# EAGLE design NixieTracker (EAGLE 7.1.0)
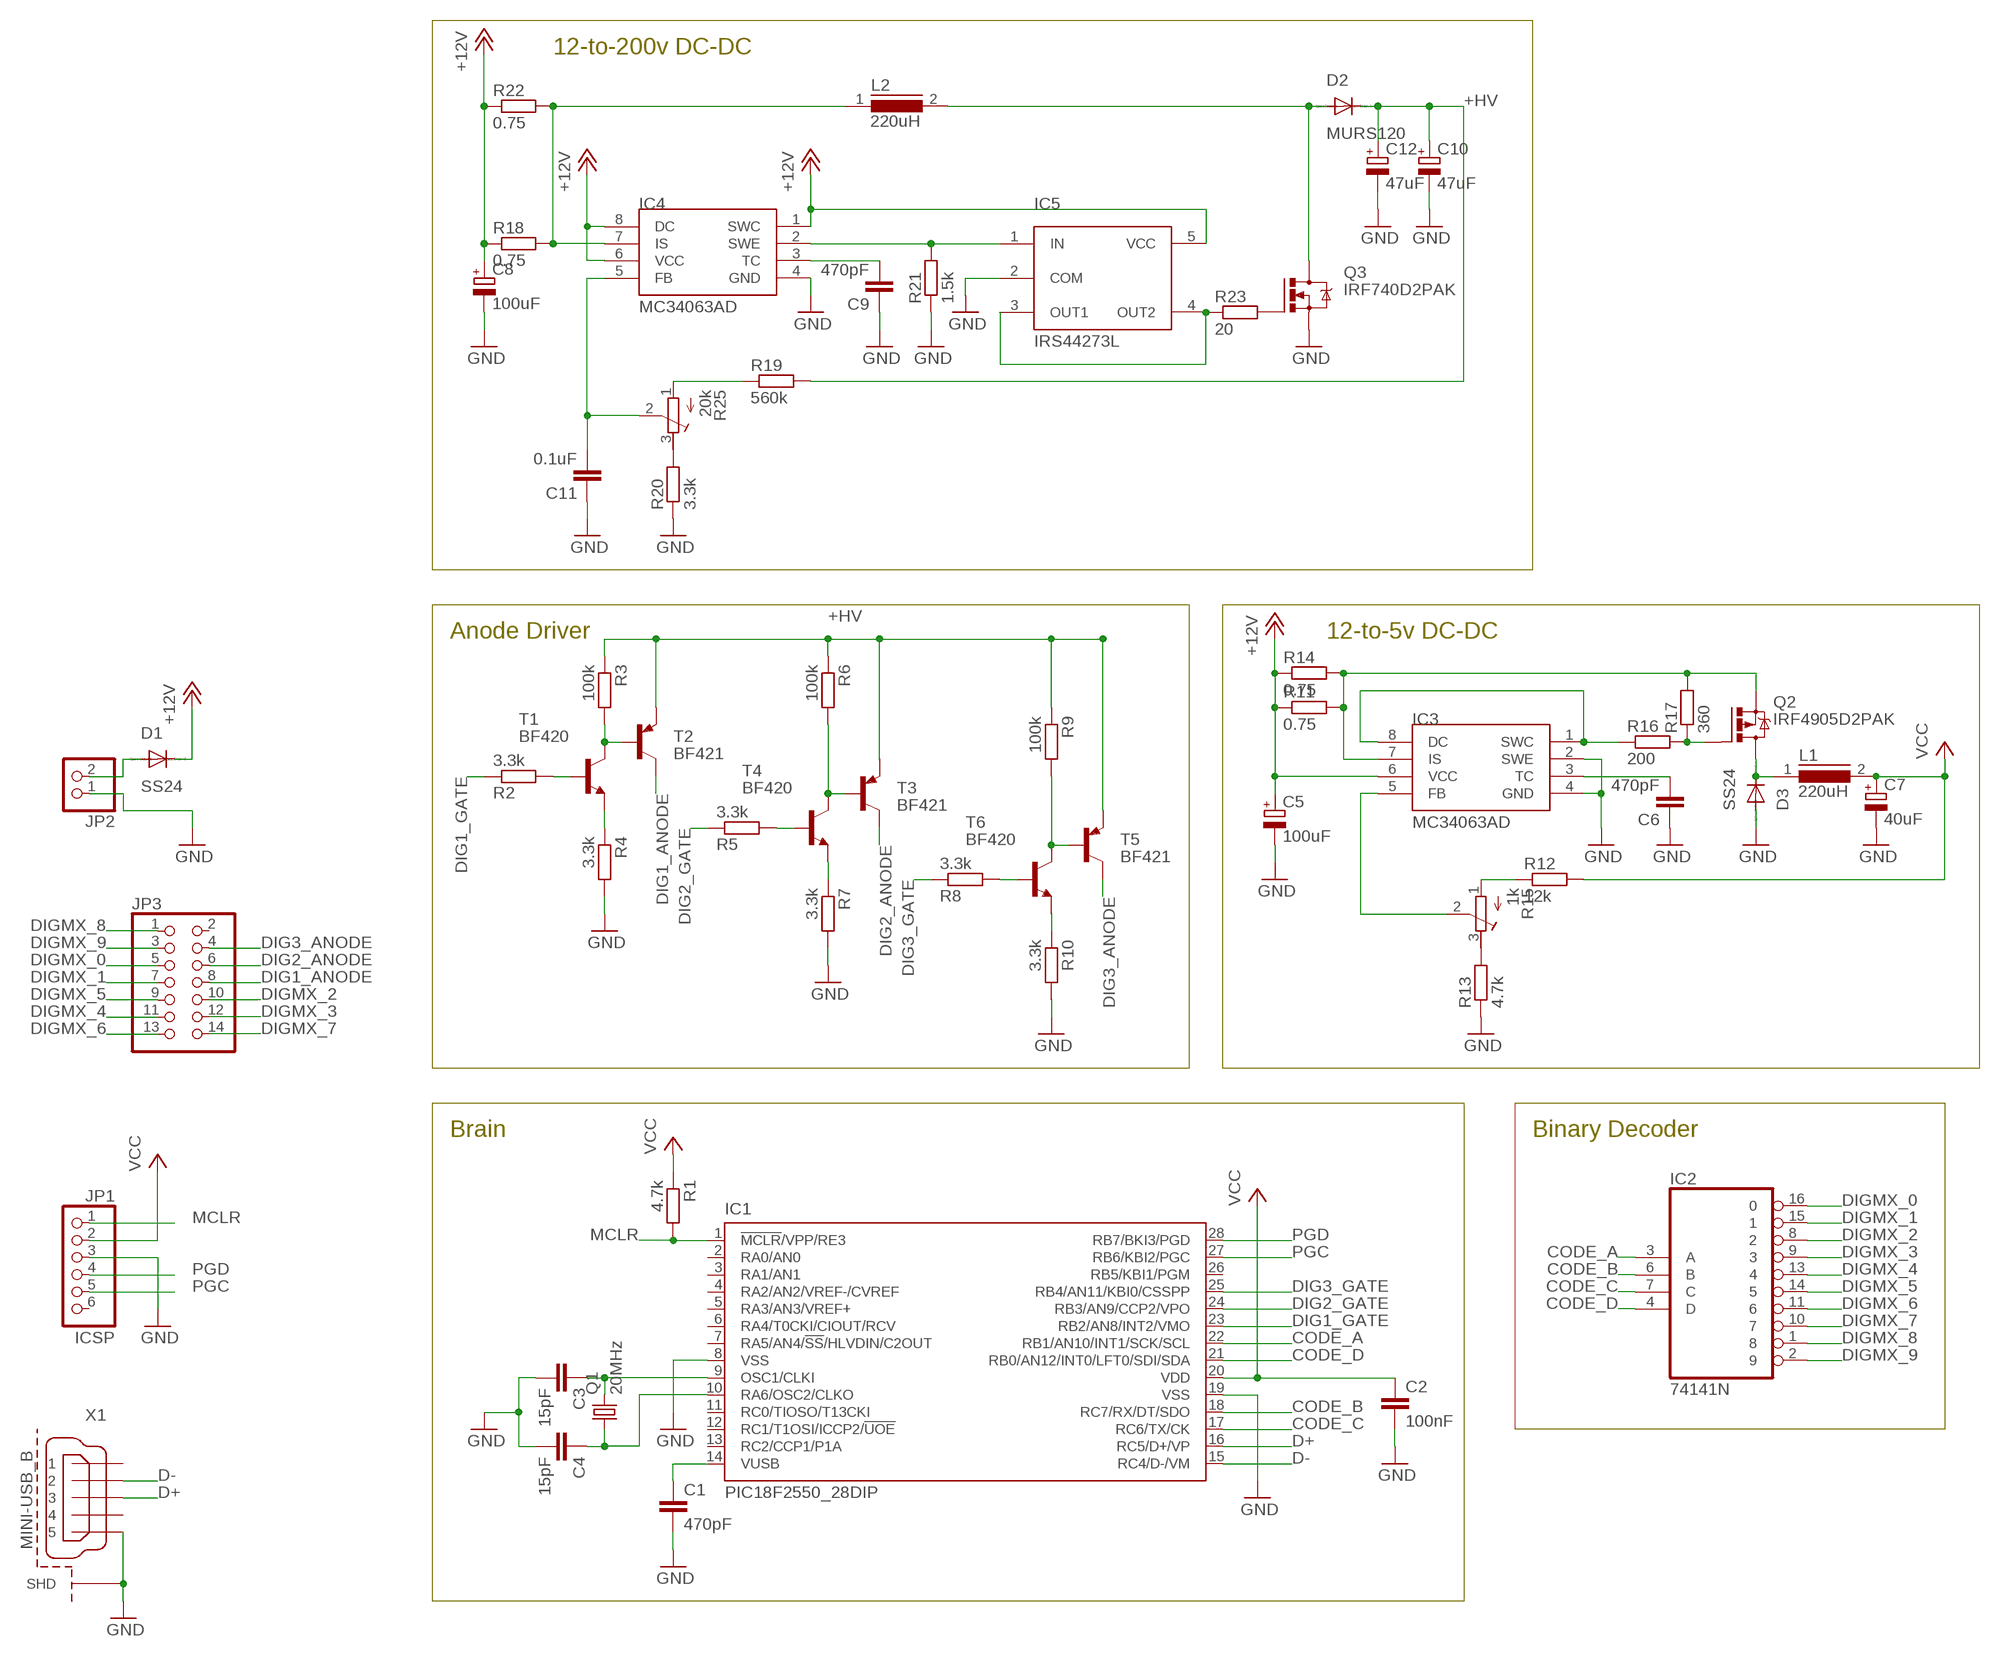
[diagram p0: schematic, sheet 1]

## Parts
C1  470pF  C-EU050-024X044  [C050-024X044]
C2  100nF  C-EU050-024X044  [C050-024X044]
C3  15pF  C-EU050-024X044  [C050-024X044]
C4  15pF  C-EU050-024X044  [C050-024X044]
C5  100uF  CPOL-EUD/7343-31R  [D/7343-31R]
C6  470pF  C-EUC1206K  [C1206K]
C7  40uF  CPOL-EUC/6032-28R  [C/6032-28R]
C8  100uF  CPOL-EUD/7343-31R  [D/7343-31R]
C9  470pF  C-EUC1206K  [C1206K]
C10  47uF  CPOL-EUSANYO_F13  [SANYO-OSCON_F13]
C11  0.1uF  C-EUC1206K  [C1206K]
C12  47uF  CPOL-EUSANYO_F13  [SANYO-OSCON_F13]
D1  SS24  DIODE-DO214AA  [DO214AA]
D2  MURS120  DIODE-DO214AA  [DO214AA]
D3  SS24  DIODE-DO214AA  [DO214AA]
IC1  PIC18F2550_28DIP  [DIL28-3]
IC2  74141N  [DIL16]
IC3  MC34063AD  [SOIC8]
IC4  MC34063AD  [SOIC8]
IC5  IRS44273L  [SOT23-5]
JP1  ICSP  PINHD-1X6  [1X06]
JP2  PINHD-1X2  [1X02]
JP3  PINHD-2X7  [2X07]
L1  220uH  DR125  [DR125]
L2  220uH  DR125  [DR125]
Q1  20MHz  CRYSTALHC49S  [HC49/S]
Q2  IRF4905D2PAK  [D2PAK]
Q3  IRF740D2PAK  [D2PAK]
R1  4.7k  R-EU_0207/2V  [0207/2V]
R2  3.3k  R-EU_0207/2V  [0207/2V]
R3  100k  R-EU_0207/5V  [0207/5V]
R4  3.3k  R-EU_0207/7  [0207/7]
R5  3.3k  R-EU_0207/2V  [0207/2V]
R6  100k  R-EU_0207/5V  [0207/5V]
R7  3.3k  R-EU_0207/7  [0207/7]
R8  3.3k  R-EU_0207/2V  [0207/2V]
R9  100k  R-EU_0207/5V  [0207/5V]
R10  3.3k  R-EU_0207/7  [0207/7]
R11  0.75  R-EU_R1206  [R1206]
R12  12k  R-EU_R1206  [R1206]
R13  4.7k  R-EU_R1206  [R1206]
R14  0.75  R-EU_R1206  [R1206]
R15  1k  R-TRIMM4G/J  [RTRIM4G/J]
R16  200  R-EU_R1206  [R1206]
R17  360  R-EU_R1206  [R1206]
R18  0.75  R-EU_R1206  [R1206]
R19  560k  R-EU_R1206  [R1206]
R20  3.3k  R-EU_R1206  [R1206]
R21  1.5k  R-EU_R1206  [R1206]
R22  0.75  R-EU_R1206  [R1206]
R23  20  R-EU_R1206  [R1206]
R25  20k  R-TRIMM4G/J  [RTRIM4G/J]
T1  BF420  BC368-NPN-TO92-ECB  [TO92-ECB]
T2  BF421  -PNP-TO92-ECB  [TO92-ECB]
T3  BF421  -PNP-TO92-ECB  [TO92-ECB]
T4  BF420  BC368-NPN-TO92-ECB  [TO92-ECB]
T5  BF421  -PNP-TO92-ECB  [TO92-ECB]
T6  BF420  BC368-NPN-TO92-ECB  [TO92-ECB]
X1  MINI-USB_B  [MINI-USB-B]

## Nets
+12V: C5.+ C8.+ D1.C IC3.6(VCC) IC4.1(SWC) IC4.6(VCC) IC4.8(DC) IC5.5(VCC) R11.1 R14.1 R18.1 R22.1
+HV: C10.+ C12.+ D2.C R3.1 R6.1 R9.1 R19.2 T2.E T3.E T5.E
CODE_A: IC1.22(RB1/AN10/INT1/SCK/SCL) IC2.3(A)
CODE_B: IC1.18(RC7/RX/DT/SDO) IC2.6(B)
CODE_C: IC1.17(RC6/TX/CK) IC2.7(C)
CODE_D: IC1.21(RB0/AN12/INT0/LFT0/SDI/SDA) IC2.4(D)
D+: IC1.16(RC5/D+/VP) X1.3
D-: IC1.15(RC4/D-/VM) X1.2
DIG1_ANODE: JP3.8 T2.C
DIG1_GATE: IC1.23(RB2/AN8/INT2/VMO) R2.1
DIG2_ANODE: JP3.6 T3.C
DIG2_GATE: IC1.24(RB3/AN9/CCP2/VPO) R5.1
DIG3_ANODE: JP3.4 T5.C
DIG3_GATE: IC1.25(RB4/AN11/KBI0/CSSPP) R8.1
DIGMX_0: IC2.16 JP3.5
DIGMX_1: IC2.15 JP3.7
DIGMX_2: IC2.8 JP3.10
DIGMX_3: IC2.9 JP3.12
DIGMX_4: IC2.13 JP3.11
DIGMX_5: IC2.14 JP3.9
DIGMX_6: IC2.11 JP3.13
DIGMX_7: IC2.10 JP3.14
DIGMX_8: IC2.1 JP3.1
DIGMX_9: IC2.2 JP3.3
GND: C1.2 C2.2 C3.2 C4.2 C5.- C6.1 C7.- C8.- C9.1 C10.- C11.1 C12.- D3.A IC1.8(VSS) IC1.19(VSS) IC3.2(SWE) IC3.4(GND) IC4.4(GND) IC5.2(COM) JP1.3 JP2.1 Q3.3(S) R4.2 R7.2 R10.2 R13.1 R20.1 R21.1 X1.5 X1.M1(SHD) X1.M2(SHD) X1.M3(SHD) X1.M4(SHD)
MCLR: IC1.1(!MCLR!/VPP/RE3) JP1.1 R1.2
N$1: C1.1 IC1.14(VUSB)
N$2: C3.1 IC1.9(OSC1/CLKI) Q1.2
N$3: C4.1 IC1.10(RA6/OSC2/CLKO) Q1.1
N$4: R3.2 T1.C T2.B
N$5: R2.2 T1.B
N$6: R4.1 T1.E
N$7: R6.2 T3.B T4.C
N$8: R7.1 T4.E
N$9: R5.2 T4.B
N$10: R9.2 T5.B T6.C
N$11: R10.1 T6.E
N$12: R8.2 T6.B
N$13: C6.2 IC3.3(TC)
N$14: IC3.5(FB) R15.2(S)
N$15: D2.A L2.2 Q3.4(D)
N$16: D1.A JP2.2
N$17: D3.C L1.1 Q2.4(D)
N$18: IC3.7(IS) Q2.3(S) R11.2 R14.2 R17.2
N$19: Q2.1(G) R16.2 R17.1
N$20: IC3.1(SWC) IC3.8(DC) R16.1
N$21: R13.2 R15.3(E)
N$22: R12.1 R15.1(A)
N$23: IC4.7(IS) L2.1 R18.2 R22.2
N$24: C9.2 IC4.3(TC)
N$25: C11.2 IC4.5(FB) R25.2(S)
N$26: IC4.2(SWE) IC5.1(IN) R21.2
N$28: Q3.1(G) R23.2
N$30: IC5.3(OUT1) IC5.4(OUT2) R23.1
N$31: R19.1 R25.1(A)
N$32: R20.2 R25.3(E)
PGC: IC1.27(RB6/KBI2/PGC) JP1.5
PGD: IC1.28(RB7/BKI3/PGD) JP1.4
VCC: C2.1 C7.+ IC1.20(VDD) JP1.2 L1.2 R1.1 R12.2
Unconnected: IC1.2(RA0/AN0) IC1.3(RA1/AN1) IC1.4(RA2/AN2/VREF-/CVREF) IC1.5(RA3/AN3/VREF+) IC1.6(RA4/T0CKI/CIOUT/RCV) IC1.7(RA5/AN4/!SS!/HLVDIN/C2OUT) IC1.11(RC0/TIOSO/T13CKI) IC1.12(RC1/T1OSI/ICCP2/!UOE) IC1.13(RC2/CCP1/P1A) IC1.26(RB5/KBI1/PGM) JP1.6 JP3.2 X1.1 X1.4

## Notes on the sheet
- 12-to-200v DC-DC
- Anode Driver | 12-to-5v DC-DC
- Brain | Binary Decoder

## Power pins joined to a net without a drawn wire
GND: IC2.12(GND)
VCC: IC2.5(VCC)

## Library data of the parts
C1-C4 C6 C9 C11 = rcl:C-EU: CAPACITOR, European symbol
C5 C7 C8 C10 C12 = rcl:CPOL-EU: POLARIZED CAPACITOR, European symbol
D1-D3 = diode:DIODE-: DIODE
IC1 = microchip:PIC18F2*_28: USB Microcontrollers with nanoWatt Technology High-Performance, Enhanced Flash, 28/40/44-Pin, Source: http://ww1.microchip.com/downloads/en/devicedoc/39632c.pdf; MF: MICROCHIP; MPN: PIC18F2550-I/SP; OC_FARNELL: 1523822; OC_NEWARK: 80K6054
IC2 = 74xx-eu:74*141: BCD to decimal DECODER/DRIVER
IC3 IC4 = mc34063:MC34063
IC5 = own-collection:IRS44273L: Single Low-Side Driver IC
JP1 = pinhead:PINHD-1X6: PIN HEADER
JP2 = pinhead:PINHD-1X2: PIN HEADER
JP3 = pinhead:PINHD-2X7: PIN HEADER
L1 L2 = inductors:DR125: High Power Density, High Efficiency, Shielded Inductors Source: coiltronics_dr_series.pdf
Q1 = crystal:CRYSTAL: CRYSTAL; OC_FARNELL: 1667008; OC_NEWARK: unknown
Q2 = own-collection:IRF4905: P-Channel HEXFET® Power MOSFET RDS(on)= 0.02 Ohm, ID = -74A Source: http://www.irf.com/product-info/datasheets/data/irf4905pbf.pdf
Q3 = own-collection:IRF740: N-CHANNEL MOS FET
R1-R10 = rcl:R-EU_: RESISTOR, European symbol
R11-R14 R16-R23 = rcl-2:R-EU_: RESISTOR, European symbol
R15 R25 = rcl:R-TRIMM: Trimm resistor
T1 T4 T6 = transistor-neu-to92:*-NPN-: NPN Transistror
T2 T3 T5 = transistor-neu-to92:*-PNP-: PNP Transistror
X1 = own-collection:MINI-USB_B: MINI USB-B R/A DIP 5pol. Source: www.cypressindustries.com

## Board
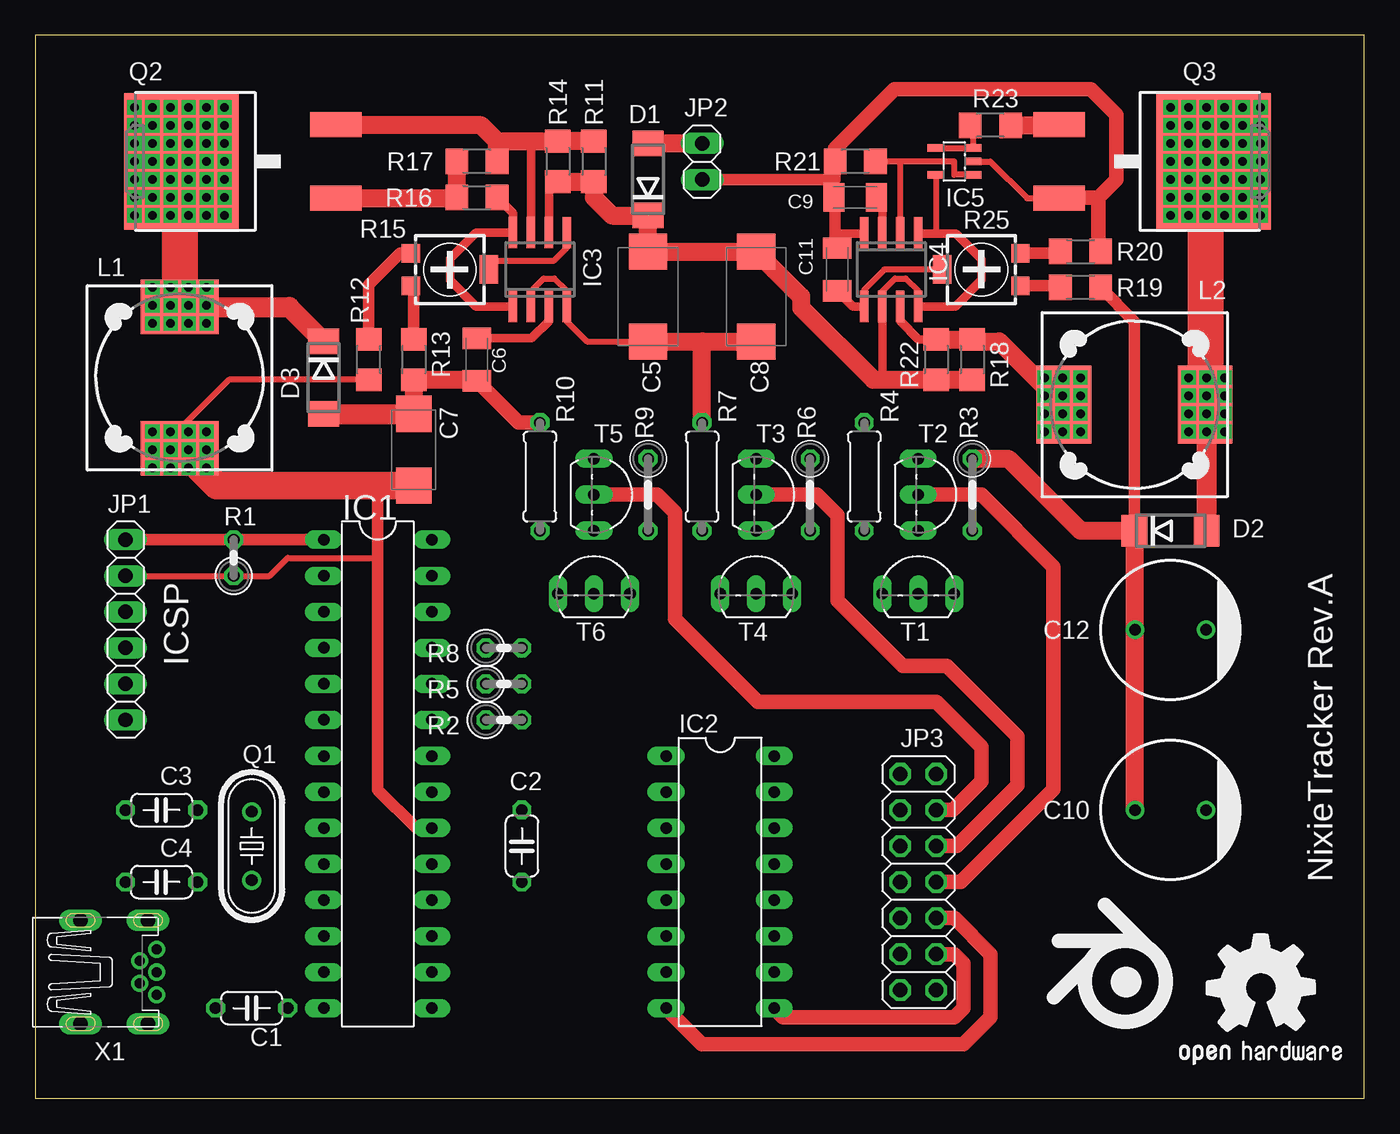
[diagram p1: board, top side]
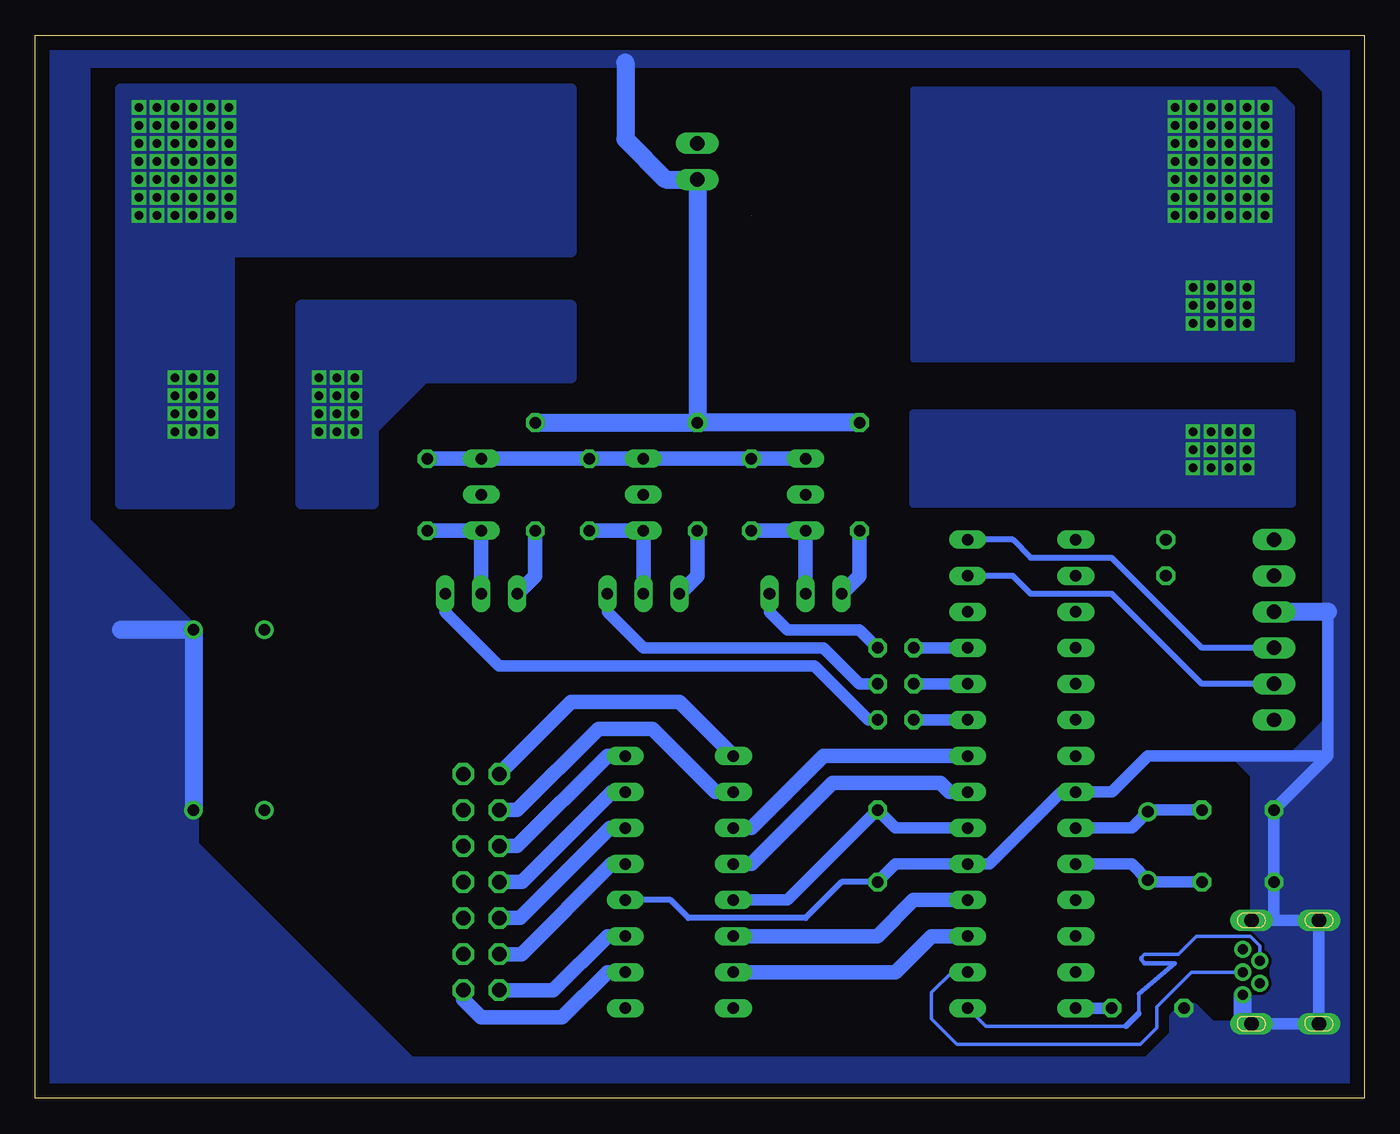
[diagram p2: board, bottom side, seen from below]

Size 93.65 x 74.92 mm. Coordinates in mm from the lower left corner, seen from the top.
Outline: 0,74.92 0,0 93.65,0 93.65,74.92 0,74.92
Copper layers (1*16): Top 0.035mm / dielectric 1.5mm / Bottom 0.035mm
Design rules "default": minimum track width 10mil, minimum drill 24mil, track to track 8mil, track to pad 8mil, pad to pad 8mil, via to via 8mil, smd to smd 8mil, copper to edge 40mil, drill to drill 8mil, minimum pad ring 10mil, minimum via ring 8mil, stop-mask expansion 4mil, vias tented up to drill 0mil, thermal gap 10mil

### Footprints (pad centres in the part's own frame; a part is rotated, then mirrored left to right if it is on the bottom)
C050-024X044 = drill 0.813 octagon: 1 -2.54,0; 2 2.54,0
D/7343-31R = smd 2.55 x 2.7: + 3.175,0; - -3.175,0
C1206K = smd 1.5 x 2: 1 -1.5,0; 2 1.5,0
C/6032-28R = smd 2.55 x 2.5: + 2.525,0; - -2.525,0
SANYO-OSCON_F13 = drill 0.8 pad 1.27: + 2.5,0; - -2.5,0
DO214AA = smd 1.8 x 2.2: A 2.55,0; C -2.55,0
DIL28-3 = drill 0.813 long: 1 -16.51,-3.81; 2 -13.97,-3.81; 3 -11.43,-3.81; 4 -8.89,-3.81; 5 -6.35,-3.81; 6 -3.81,-3.81; 7 -1.27,-3.81; 8 1.27,-3.81; 9 3.81,-3.81; 10 6.35,-3.81; 11 8.89,-3.81; 12 11.43,-3.81; 13 13.97,-3.81; 14 16.51,-3.81; 15 16.51,3.81; 16 13.97,3.81; 17 11.43,3.81; 18 8.89,3.81; 19 6.35,3.81; 20 3.81,3.81; 21 1.27,3.81; 22 -1.27,3.81; 23 -3.81,3.81; 24 -6.35,3.81; 25 -8.89,3.81; 26 -11.43,3.81; 27 -13.97,3.81; 28 -16.51,3.81
DIL16 = drill 0.813 long: 1 -8.89,-3.81; 2 -6.35,-3.81; 3 -3.81,-3.81; 4 -1.27,-3.81; 5 1.27,-3.81; 6 3.81,-3.81; 7 6.35,-3.81; 8 8.89,-3.81; 9 8.89,3.81; 10 6.35,3.81; 11 3.81,3.81; 12 1.27,3.81; 13 -1.27,3.81; 14 -3.81,3.81; 15 -6.35,3.81; 16 -8.89,3.81
SOIC8 = smd 0.6 x 2.2: 1 -1.905,-2.6; 2 -0.635,-2.6; 3 0.635,-2.6; 4 1.905,-2.6; 5 1.905,2.6; 6 0.635,2.6; 7 -0.635,2.6; 8 -1.905,2.6
SOT23-5 = smd 0.55 x 1.2: 1 -0.95,-1.3; 2 0,-1.3; 3 0.95,-1.3; 4 0.95,1.3; 5 -0.95,1.3
1X06 = drill 1.016 long: 1 -6.35,0; 2 -3.81,0; 3 -1.27,0; 4 1.27,0; 5 3.81,0; 6 6.35,0
1X02 = drill 1.016 long: 1 -1.27,0; 2 1.27,0
2X07 = drill 1.016 octagon: 1 -7.62,-1.27; 2 -7.62,1.27; 3 -5.08,-1.27; 4 -5.08,1.27; 5 -2.54,-1.27; 6 -2.54,1.27; 7 0,-1.27; 8 0,1.27; 9 2.54,-1.27; 10 2.54,1.27; 11 5.08,-1.27; 12 5.08,1.27; 13 7.62,-1.27; 14 7.62,1.27
DR125 = smd 3.85 x 5.5: 1 -4.975,0; 2 4.975,0
HC49/S = drill 0.813: 1 -2.413,0; 2 2.413,0
D2PAK = smd 1.78 x 3.635: 1 -2.598,-5.31; 3 2.598,-5.31 | smd 9.652 x 8.066: 4 0,5.588
0207/2V = drill 0.813 octagon: 1 -1.27,0; 2 1.27,0
0207/5V = drill 0.813 octagon: 1 -2.54,0; 2 2.54,0
0207/7 = drill 0.813 octagon: 1 -3.81,0; 2 3.81,0
R1206 = smd 1.6 x 1.803: 1 -1.422,0; 2 1.422,0
RTRIM4G/J = smd 1.3 x 1.3: 1 -1.15,-2.75; 3 1.15,-2.75 | smd 2 x 1.3: 2 0,2.75
TO92-ECB = drill 0.813 long: B 2.54,0; C 0,0; E -2.54,0
MINI-USB-B = drill 0.7 pad 1.016: 1 4.095,1.6; 2 2.895,0.8; 3 4.095,0; 4 2.895,-0.8; 5 4.095,-1.6 | drill 1 pad 1.422 long: M1 3.49,3.65; M2 3.49,-3.65; M3 -1.272,-3.65; M4 -1.272,3.65

### Placement (x,y rotation side)
C1  15.24,6.35 180 top
C2  34.29,17.78 270 top
C3  8.89,20.32 180 top
C4  8.89,15.24 180 top
C5  43.18,56.52 90 top
C6  31.11,52.07 90 top
C7  26.67,45.72 270 top
C8  50.8,56.52 90 top
C9  57.78,63.5 0 top
C10  80.01,20.32 180 top
C11  56.52,58.42 270 top
C12  80.01,33.02 180 top
D1  43.18,64.77 90 top
D2  80.01,40.01 0 top
D3  20.32,50.8 270 top
IC1  24.13,22.86 270 top
IC2  48.26,15.24 270 top
IC3  35.56,58.42 0 top
IC4  60.33,58.42 180 top
IC5  64.77,66.04 90 top
JP1  6.35,33.02 270 top
JP2  46.99,66.04 90 top
JP3  62.23,15.24 270 top
L1  10.16,50.8 270 top
L2  77.47,48.9 0 top
Q1  15.24,17.78 90 top
Q2  15.88,66.04 90 top
Q3  77.47,66.04 270 top
R1  13.97,38.1 90 top
R2  33.02,26.67 0 top
R3  66.04,42.55 270 top
R4  58.42,43.81 90 top
R5  33.02,29.21 0 top
R6  54.61,42.55 270 top
R7  46.99,43.81 90 top
R8  33.02,31.75 0 top
R9  43.18,42.55 270 top
R10  35.56,43.81 90 top
R11  39.37,66.04 90 top
R12  23.5,52.07 270 top
R13  26.67,52.07 90 top
R14  36.83,66.04 90 top
R15  29.21,58.42 270 top
R16  31.11,63.5 180 top
R17  31.11,66.04 0 top
R18  66.04,52.07 90 top
R19  73.66,57.15 0 top
R20  73.66,59.69 180 top
R21  57.78,66.04 0 top
R22  63.5,52.07 90 top
R23  67.31,68.58 0 top
R25  66.67,58.42 90 top
T1  62.23,35.56 0 top
T2  62.23,42.55 270 top
T3  50.8,42.55 270 top
T4  50.8,35.56 0 top
T5  39.37,42.55 270 top
T6  39.37,35.56 0 top
U$1  [OSHW1]  80.01,0.64 0 top
X1  4.45,8.89 0 top

### Tracks (layer width: path | path; a pad name or v marks a point on that pad's centre or on a via)
+12V  (1 unrouted)
  Top 0.406: 36.2,64.62 R14.1 | IC4.1 62.29,60.96 | IC4.8 62.23,56.89 61.33,57.78 60.59,57.78 59.69,56.89 IC4.6 | IC5.5 63.47,60.96 63.5,60.96
  Top 0.61: IC3.6 36.2,64.62 | 62.29,60.96 63.47,60.96 | 63.5,60.96 64.88,60.96 66.67,59.16 66.67,57.66 64.84,55.82 IC4.8 | IC4.6 59.69,50.65
  Top 1.27: R14.1 R11.1 39.37,63.5 40.64,62.23 D1.C | D1.C C5.+ C8.+ 53.98,56.52 53.98,55.73 59.05,50.65 59.69,50.65 R22.1 R18.1
+HV
  Top 0.813: R19.2 77.47,54.76 D2.C
  Top 1.27: R3.1 68.58,45.09 73.66,40.01 D2.C | D2.C 77.47,33.02 C12.+ C10.+
  Bottom 1.016: T5.E R9.1 T3.E R6.1 T2.E R3.1
CODE_A
  Bottom 1.016: IC1.22 38.1,24.13 43.18,19.05 IC2.3
CODE_B
  Bottom 1.016: IC1.18 31.75,13.97 34.29,11.43 IC2.6
CODE_C
  Bottom 1.016: IC1.17 30.48,11.43 33.02,8.89 IC2.7
CODE_D
  Bottom 1.016: IC2.4 43.18,16.51 37.47,22.23 29.84,22.23 29.21,21.59 IC1.21
D+
  Bottom 0.254: X1.3 12.17,8.89 14.61,6.46 14.61,4.97 15.77,3.81 28.68,3.81 30.48,5.61 30.48,7.47 29.06,8.89 IC1.16
D-
  Bottom 0.254: IC1.15 26.67,5.08 16.77,5.08 | 15.88,5.98 15.88,7.36 | 15.71,9.91 15.49,10.16 13.08,10.16 11.81,11.43 8.03,11.43 7.34,10.74 X1.2
  Bottom 0.305: 15.88,7.36 13.34,9.53 15.49,9.53 15.71,9.78 15.71,9.91
  Bottom 0.406: 16.77,5.08 15.88,5.98
DIG1_ANODE
  Top 1.016: T2.C 66.67,42.55 71.75,37.47 71.75,21.78 65.22,15.24 JP3.8
DIG1_GATE
  Bottom 0.813: IC1.23 R2.1
DIG2_ANODE
  Top 1.016: T3.C 55.09,42.55 56.52,41.12 56.52,35.1 61.14,30.48 64.25,30.48 69.22,25.52 69.22,22.04 64.95,17.78 JP3.6
DIG2_GATE
  Bottom 0.813: IC1.24 R5.1
DIG3_ANODE
  Top 1.016: T5.C 43.81,42.55 45.09,41.27 45.09,33.79 50.94,27.94 63.5,27.94 66.67,24.77 66.67,22.33 64.67,20.32 JP3.4
DIG3_GATE
  Bottom 0.813: IC1.25 R8.1
DIGMX_0
  Bottom 1.016: IC2.16 53.34,24.13 59.69,17.78 JP3.5
DIGMX_1
  Bottom 1.016: IC2.15 52.99,21.59 59.34,15.24 JP3.7
DIGMX_2
  Top 1.016: IC2.8 46.99,3.81 65.41,3.81 67.31,5.71 67.31,10.16 64.77,12.7 JP3.10
DIGMX_3
  Top 1.016: IC2.9 52.7,5.71 64.77,5.71 65.41,6.35 65.41,9.53 64.77,10.16 JP3.12
DIGMX_4
  Bottom 1.016: IC2.13 53.04,16.51 59.39,10.16 JP3.11
DIGMX_5
  Bottom 1.016: IC2.14 53.13,19.05 59.48,12.7 JP3.9
DIGMX_6
  Bottom 1.016: IC2.11 53.34,11.43 57.15,7.62 JP3.13
DIGMX_7
  Bottom 1.016: IC2.10 53.34,8.89 56.52,5.71 62.23,5.71 63.5,6.99 JP3.14
DIGMX_8
  Bottom 1.016: IC2.1 48.26,27.94 55.88,27.94 JP3.1
DIGMX_9
  Bottom 1.016: IC2.2 45.72,21.59 50.16,26.04 53.98,26.04 59.69,20.32 JP3.3
GND
  Top 0.406: D3.A | IC3.2 34.92,56.89 35.82,57.78 36.57,57.78 37.47,56.89 IC3.4 37.47,54.76 38.88,53.34 C5.- | 31.11,50.65 C6.1 | 55.88,63.5 C9.1 | IC5.2 67.31,66.04 69.91,63.44 Q3.3 | IC4.4 58.42,60.96
  Top 0.61: 58.42,60.96 56.36,60.96
  Top 0.813: R20.1 74.93,59.69 | C11.1 56.36,59.92 56.36,60.96 56.36,63.5 C9.1 56.28,64.77 | R21.1 56.36,64.77 56.28,64.77 | 56.28,64.77 JP2.1 | Q3.3 72.16,63.5
  Top 1.016: 74.93,59.69 74.93,63.5 | 74.93,63.5 76.2,64.77 76.2,69.32 74.4,71.12 60.55,71.12 56.36,66.93 R21.1 | 72.16,63.5 74.93,63.5 | C6.1 34.06,47.62 R10.2
  Top 1.27: C7.- R13.1 31.11,50.65 | C5.- 46.99,53.34 | 46.99,53.34 C8.- | R7.2 46.99,53.34
  Top 1.422: D3.A C7.-
  Bottom 0.406: X1.5 8.57,7.26 | C2.2 36.83,15.24 39.37,12.7 47.62,12.7 48.9,13.97 IC2.12 | 8.57,5.24 X1.M2
  Bottom 0.813: X1.M2 X1.M3 X1.M4 6.35,12.54 | X1.M1 6.35,12.54 | 6.35,12.54 C4.2 C3.2 2.54,24.13 | 2.54,24.13 2.54,34.29 | 2.54,24.13 15.24,24.13 17.78,21.59 IC1.8 21.34,21.59 26.42,16.51 IC1.19 33.02,16.51 C2.2
  Bottom 1.27: R10.2 R7.2 | R4.2 R7.2 | 2.54,34.29 JP1.3 | 52.07,73.03 52.07,67.61 49.23,64.77 JP2.1 R7.2 | C10.- C12.- 87.63,33.02 | 8.57,7.26 8.57,5.24
  pour Bottom (no thermals): -0.64,34.29 2.54,34.29 2.54,26.42 4.83,24.13 8.89,24.13 7.62,22.86 7.62,5.08 10.79,5.08 12.06,6.35 12.7,6.35 13.34,5.71 13.34,0 0,0
  pour Bottom: -0.64,34.29 0,74.93 52.07,74.93 52.07,73.03 4.45,73.03 2.54,71.12 2.54,34.29
  pour Bottom (no thermals): 12.7,0 93.98,0 93.98,74.93 52.07,74.93 52.07,73.03 90.17,73.03 90.17,40.64 82.55,33.02 82.55,17.83 67.26,2.54 15.24,2.54 12.7,5.08
MCLR
  Top 0.813: IC1.1 R1.2 JP1.1
N$1
  Bottom 0.813: C1.1 IC1.14
N$2
  Bottom 0.406: 15.24,20.32 Q1.2
  Bottom 0.813: Q1.2 16.38,19.05 IC1.9 | C3.1 15.24,20.32
N$3
  Bottom 0.406: 15.24,15.24 Q1.1
  Bottom 0.813: Q1.1 16.38,16.51 IC1.10 | C4.1 15.24,15.24
N$4
  Bottom 1.016: R3.2 T2.B T1.C
N$5
  Bottom 0.813: T1.B 64.77,34.29 60.96,30.48 38.73,30.48 34.92,26.67 R2.2
N$6
  Bottom 1.016: R4.1 58.42,36.83 T1.E
N$7
  Bottom 1.016: R6.2 T3.B T4.C
N$8
  Bottom 1.016: R7.1 46.99,36.83 T4.E
N$9
  Bottom 0.813: T4.B 53.34,34.29 50.8,31.75 38.1,31.75 35.56,29.21 R5.2
N$10
  Bottom 1.016: R9.2 T5.B T6.C
N$11
  Bottom 1.016: R10.1 35.56,36.83 T6.E
N$12
  Bottom 0.813: T6.B 41.91,34.29 40.64,33.02 35.56,33.02 R8.2
N$13
  Top 0.61: C6.2 34.98,53.57 36.2,54.79 IC3.3
N$14
  Top 0.406: R15.2 31.96,59.05 36.57,59.05 37.47,59.95 IC3.5
N$15  (via drill 0.6)
  Top 0.406: Q3.4 82.44,65.43 | L2.2 82.56,50.69
  Top 0.813: 82.56,48.9 L2.2 | v80.01,69.85 v81.28,69.85 v82.55,69.85 | v82.55,69.85 v83.82,69.85 v85.09,69.85 v86.36,69.85 | v82.55,69.85 83.06,69.85 Q3.4 | 83.06,64.77 v85.09,64.77 | v85.09,68.58 v86.36,68.58 | v85.09,64.77 v85.09,68.58 | v85.09,68.58 v83.82,68.58 v82.55,68.58 v81.28,68.58 v80.01,68.58 | v80.01,67.31 v81.28,67.31 v82.55,67.31 v83.82,67.31 v85.09,67.31 v86.36,67.31 | v80.01,66.04 v81.28,66.04 v82.55,66.04 v83.82,66.04 v85.09,66.04 v86.36,66.04 | v80.01,64.77 v81.28,64.77 v82.55,64.77 v83.82,64.77 v85.09,64.77 | v85.09,64.77 v86.36,64.77 | v80.01,63.5 v81.28,63.5 v82.55,63.5 v83.82,63.5 v85.09,63.5 v86.36,63.5 | v80.01,62.23 v81.28,62.23 v82.55,62.23 v83.82,62.23 v85.09,62.23 v86.36,62.23
  Top 1.422: D2.A 82.56,48.9
  Top 2.54: 82.44,65.43 L2.2
  other vias: 81.28,50.8 82.55,50.8 83.82,50.8 81.28,48.26 82.55,48.26 83.82,48.26 81.28,49.53 82.55,49.53 83.82,49.53 81.28,46.99 82.55,46.99 83.82,46.99
  pour Bottom: 87.63,71.12 55.88,71.12 55.88,59.69 80.01,59.69 80.01,41.91 87.63,41.91
N$16
  Top 0.406: D1.A
  Top 1.27: D1.A JP2.2
N$17  (via drill 0.6)
  Top 0.406: Q2.4 10.16,64.77
  Top 0.61: v6.99,69.85 v6.99,68.58 | v6.99,68.58 10.29,68.58 Q2.4 | v6.99,68.58 v8.26,68.58 v9.53,68.58 v10.79,68.58 v12.06,68.58 v13.34,68.58 | v6.99,67.31 v8.26,67.31 v9.53,67.31 v10.79,67.31 v12.06,67.31 v13.34,67.31 | v6.99,66.04 v8.26,66.04 v9.53,66.04 v10.79,66.04 v12.06,66.04 v13.34,66.04 | v6.99,64.77 v8.26,64.77 v9.53,64.77 v10.79,64.77 v12.06,64.77 v13.34,64.77 | v6.99,63.5 v8.26,63.5 v9.53,63.5 v10.79,63.5 v12.06,63.5 v13.34,63.5 | v6.99,62.23 v8.26,62.23 v9.53,62.23 v10.79,62.23 v12.06,62.23 v13.34,62.23
  Top 1.422: L1.1 17.89,55.77 D3.C
  Top 2.54: 10.16,64.77 L1.1
  other vias: 8.26,69.85 9.53,69.85 10.79,69.85 12.06,69.85 13.34,69.85 8.26,57.15 9.53,57.15 10.79,57.15 12.06,57.15 8.26,55.88 9.53,55.88 10.79,55.88 12.06,55.88 8.26,54.61 9.53,54.61 10.79,54.61 12.06,54.61
  pour Bottom (no thermals): 5.08,52.07 31.75,52.07 31.75,71.12 6.35,71.12 5.08,69.85
N$18
  Top 0.406: Q2.3 21.18,68.58
  Top 0.61: IC3.7 34.92,67.46
  Top 1.27: R11.2 R14.2 34.92,67.46 32.54,67.46 | R17.2 32.54,67.46 | 32.54,67.46 31.42,68.58 21.18,68.58
N$19
  Top 0.406: 29.64,63.44 R16.2
  Top 1.27: R17.1 R16.2 | Q2.1 29.64,63.44
N$20
  Top 0.61: R16.1 33.66,62.38 IC3.8 31.05,61.02 29.21,59.18 29.21,57.66 31.05,55.82 IC3.1
N$21
  Top 0.406: 26.67,57.27 R15.3
  Top 0.813: R13.2 26.67,57.27
N$22
  Top 0.813: R12.1 23.5,57.34 25.72,59.57 R15.1
N$23  (via drill 0.6)
  Top 0.61: IC4.7 60.96,54.77 62.24,53.49 R22.2
  Top 0.813: 72.39,48.9 v72.39,50.8
  Top 1.27: R22.2 R18.2 66.04,53.34 67.94,53.34 72.39,48.9 L2.1
  other vias: 71.12,50.8 73.66,50.8 71.12,49.53 71.12,48.26 71.12,46.99 72.39,49.53 72.39,48.26 72.39,46.99 73.66,49.53 73.66,48.26 73.66,46.99
  pour Bottom: 74.93,55.88 55.88,55.88 55.88,50.8 66.26,50.8 69.85,47.21 69.85,41.91 74.93,41.91
N$24
  Top 0.406: 59.69,63.5 C9.2
  Top 0.61: IC4.3 59.69,63.5
N$25
  Top 0.406: R25.2 59.84,58.42 58.42,57 IC4.5
  Top 0.61: C11.2 57.62,55.82 IC4.5
N$26
  Top 0.406: IC4.2 60.96,66.04 | 60.96,66.04 R21.2 | IC5.1 64.77,65.09 64.77,66.04 60.96,66.04
N$28
  Top 0.406: 72.16,68.58 Q3.1
  Top 1.27: R23.2 72.16,68.58
N$30
  Top 0.406: IC5.4 IC5.3 66.07,68.58 R23.1
N$31
  Top 0.813: R25.1 72.24,57.27 R19.1
N$32
  Top 0.813: R25.3 72.24,59.57 R20.2
PGC
  Bottom 0.406: JP1.5 11.43,29.21 17.78,35.56 23.5,35.56 24.77,36.83 IC1.27
PGD
  Bottom 0.406: JP1.4 11.43,31.75 17.78,38.1 23.5,38.1 24.77,39.37 IC1.28
VCC  (via drill 0.6)
  Top 0.406: R12.2 13.65,50.65 10.16,47.16 L1.2 | 24.13,38.1 17.78,38.1 16.51,36.83 R1.1 JP1.2
  Top 0.813: IC1.20 26.82,19.05 24.13,21.74 24.13,38.1 24.13,43.2 | v9.53,45.72 10.16,45.72 L1.2
  Top 1.93: C7.+ 24.13,43.2 12.79,43.2 L1.2
  Bottom 0.813: IC1.20 33.02,19.05 C2.1 40.64,13.97 IC2.5
  other vias: 8.26,46.99 9.53,46.99 10.79,46.99 12.06,46.99 8.26,45.72 10.79,45.72 12.06,45.72 8.26,44.45 9.53,44.45 10.79,44.45 12.06,44.45
  pour Bottom (no thermals): 5.08,48.26 31.75,48.26 31.75,41.91 5.08,41.91

### Text on the board
tPlace: ICSP | NixieTracker Rev.A